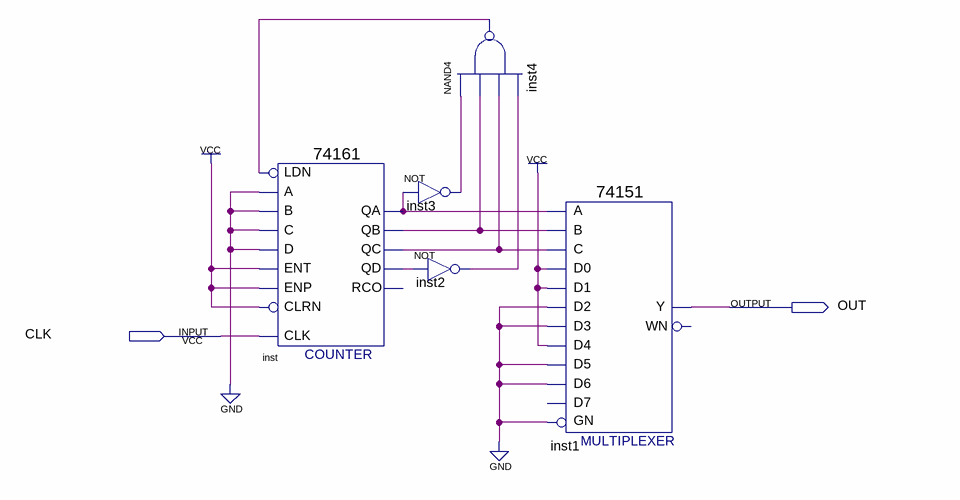
[diagram p0: schematic sheet]
// Quartus schematic 74161_SeqGenerator.bdf as structural Verilog: 5 symbols, 2 pins
module \74161_SeqGenerator  (
  input  CLK,
  output OUT
);

  wire inst2_out, inst3_out, inst4_out, inst_qa, inst_qb, inst_qc, inst_qd;

  \74161  inst (
    .CLRN(1'b1), .CLK(CLK), .ENP(1'b1), .LDN(inst4_out), .A(1'b0), .D(1'b0), .ENT(1'b1), .B(1'b0), .C(1'b0),
    .QD(inst_qd), .QC(inst_qc), .QB(inst_qb), .QA(inst_qa));  // open: RCO
  nand inst4 (inst4_out, inst3_out, inst_qb, inst_qc, inst2_out);
  not inst3 (inst3_out, inst_qa);
  not inst2 (inst2_out, inst_qd);
  \74151  inst1 (
    .GN(1'b0), .C(inst_qc), .B(inst_qb), .A(inst_qa), .D5(1'b0), .D0(1'b1), .D1(1'b1), .D4(1'b1), .D3(1'b0),
    .D2(1'b0), .D6(1'b0), .Y(OUT));  // open: D7, WN
endmodule
